# EAGLE design SO-16 (EAGLE 6.5.0)
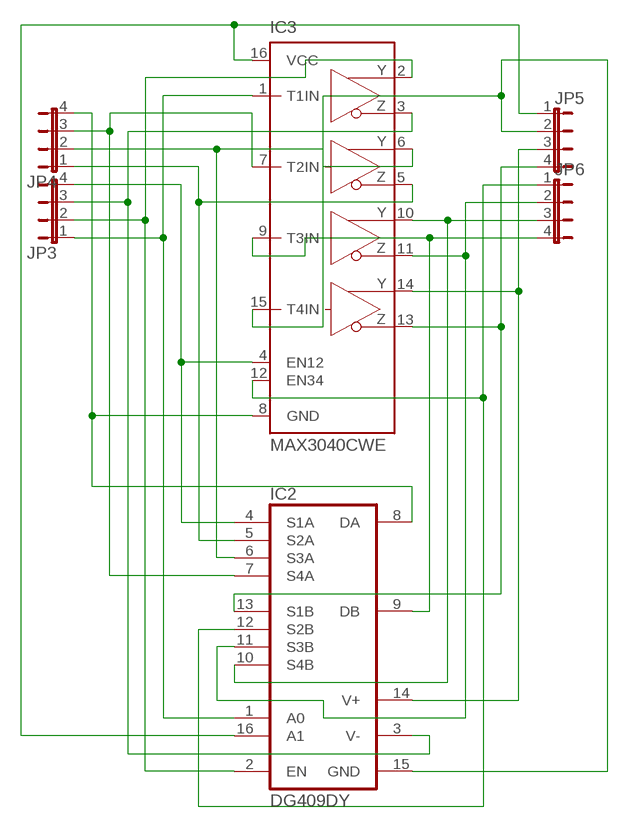
[diagram p0: schematic, sheet 1]

## Parts
IC2  DG409DY  [SO16]
IC3  MAX3040CWE  [SO16L]
JP3  JP4E  [JP4]
JP4  JP4E  [JP4]
JP5  JP4E  [JP4]
JP6  JP4E  [JP4]

## Nets
N$8: IC2.1(A0) IC3.1(T1IN) JP3.1
N$10: IC2.3(V-) IC3.3(Z1) JP3.3
N$11: IC2.2(EN) IC3.2(Y1) JP3.2
N$12: IC2.4(S1A) IC3.4(EN12) JP3.4
N$13: IC2.5(S2A) IC3.5(Z2) JP4.1
N$14: IC2.6(S3A) IC3.6(Y2) JP4.2
N$15: IC2.7(S4A) IC3.7(T2IN) JP4.3
N$16: IC2.8(DA) IC3.8(GND) JP4.4
N$17: IC2.13(S1B) IC3.13(Z4) JP5.4
N$18: IC2.9(DB) IC3.9(T3IN) JP6.4
N$19: IC2.10(S4B) IC3.10(Y3) JP6.3
N$20: IC2.12(S2B) IC3.12(EN34) JP6.1
N$21: IC2.11(S3B) IC3.11(Z3) JP6.2
N$22: IC2.15(GND) IC3.15(T4IN) JP5.2
N$23: IC2.14(V+) IC3.14(Y4) JP5.3
N$25: IC2.16(A1) IC3.16(VCC) JP5.1

## Library data of the parts
IC2 = maxim:DG409DY: ANALOG MULTIPLEXER; MF: MAXIM; MPN: DG409DY; OC_FARNELL: 9663835; OC_NEWARK: 90C1278
IC3 = maxim:MAX30*: ±10kV ESD-Protected, Quad 5V RS-485/RS-422 Transmitters Source: www.maxim-ic.com .. MAX3040-MAX3045.pdf; MPN: MAX3040CWE+; OC_FARNELL: unknown; OC_NEWARK: 68K4574
JP3-JP6 = jumper:JP4E: JUMPER

## Board
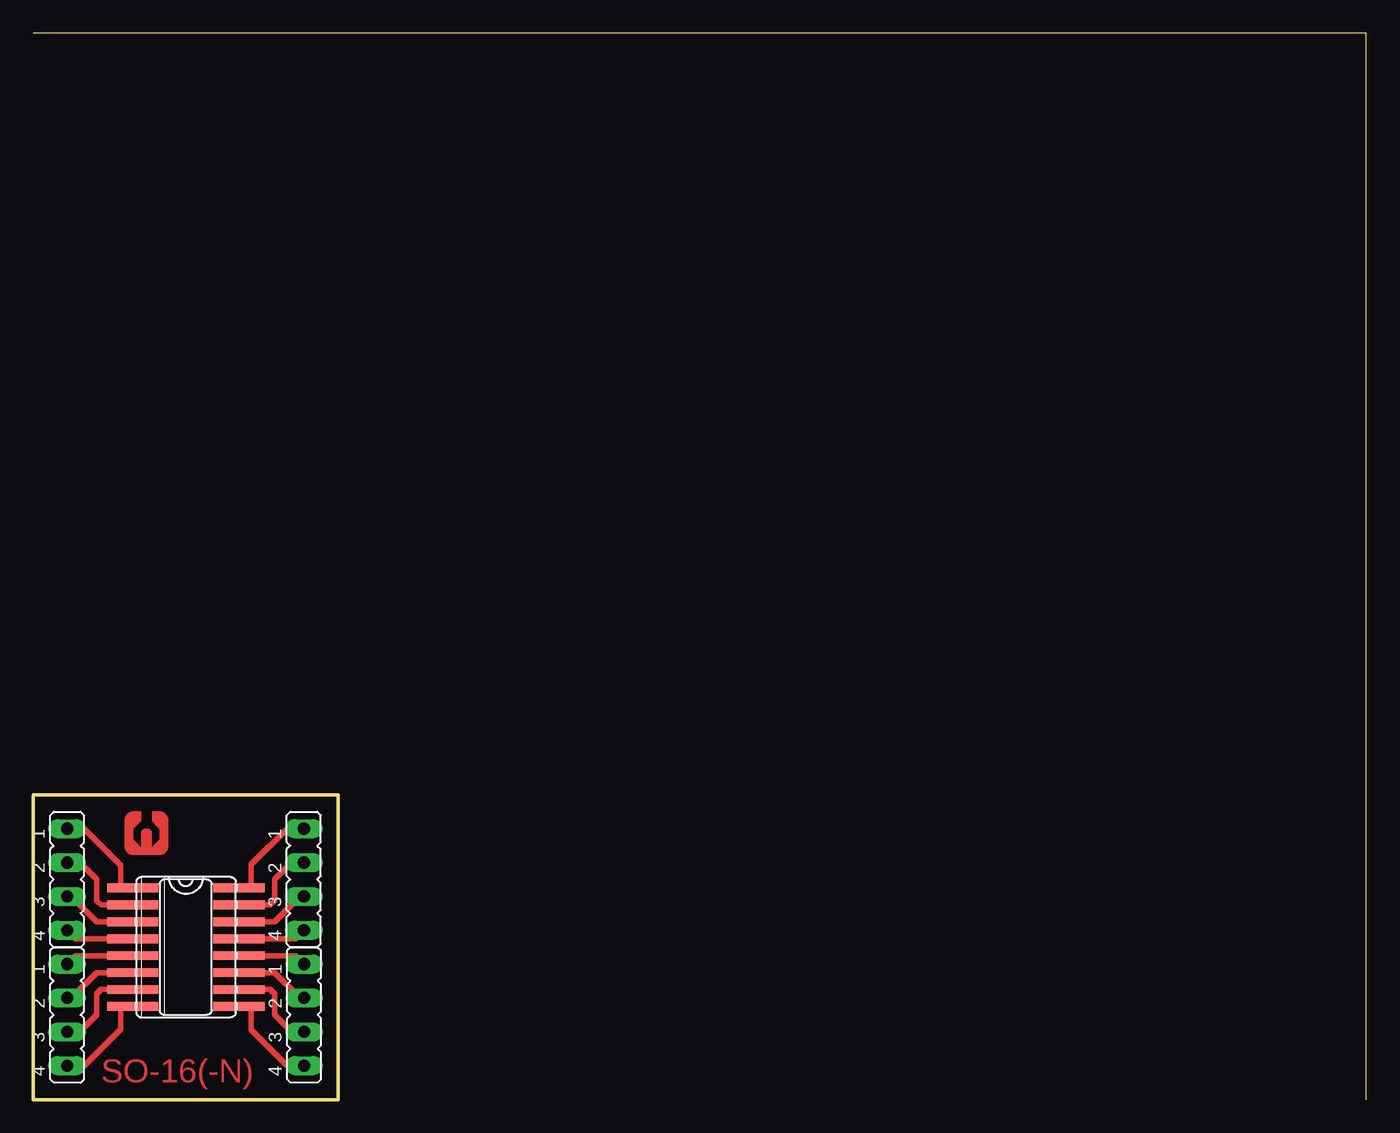
[diagram p1: board, top side]

Size 100 x 80 mm. Coordinates in mm from the lower left corner, seen from the top.
Outline: 100,0 100,80 0,80
Outline: 0,0 0,22.86 22.86,22.86 22.86,0 0,0
Copper layers (1*16): Top 0.035mm / dielectric 1.5mm / Bottom 0.035mm
Design rules "default": minimum track width 10mil, minimum drill 24mil, track to track 8mil, track to pad 8mil, pad to pad 8mil, via to via 8mil, smd to smd 8mil, copper to edge 40mil, drill to drill 8mil, minimum pad ring 10mil, minimum via ring 8mil, stop-mask expansion 4mil, vias tented up to drill 0mil, thermal gap 10mil

### Footprints (pad centres in the part's own frame; a part is rotated, then mirrored left to right if it is on the bottom)
SO16 = smd 0.66 x 2.032: 1 -4.445,-3.073; 2 -3.175,-3.073; 3 -1.905,-3.073; 4 -0.635,-3.073; 5 0.635,-3.073; 6 1.905,-3.073; 7 3.175,-3.073; 8 4.445,-3.073; 9 4.445,3.073; 10 3.175,3.073; 11 1.905,3.073; 12 0.635,3.073; 13 -0.635,3.073; 14 -1.905,3.073; 15 -3.175,3.073; 16 -4.445,3.073
SO16L = smd 0.66 x 2.032: 1 -4.445,-4.902; 2 -3.175,-4.902; 3 -1.905,-4.902; 4 -0.635,-4.902; 5 0.635,-4.902; 6 1.905,-4.902; 7 3.175,-4.902; 8 4.445,-4.902; 9 4.445,4.902; 10 3.175,4.902; 11 1.905,4.902; 12 0.635,4.902; 13 -0.635,4.902; 14 -1.905,4.902; 15 -3.175,4.902; 16 -4.445,4.902
JP4 = drill 0.914 long: 1 -3.81,0; 2 -1.27,0; 3 1.27,0; 4 3.81,0

### Placement (x,y rotation side)
IC2  11.43,11.43 270 top
IC3  11.46,11.43 270 top
JP3  2.54,16.51 270 top
JP4  2.54,6.35 270 top
JP5  20.29,16.51 270 top
JP6  20.32,6.35 270 top

### Tracks (layer width: path | path; a pad name or v marks a point on that pad's centre or on a via)
N$8
  Top 0.406: IC2.1 IC3.1 6.55,17.58 3.81,20.32 JP3.1
N$10
  Top 0.406: IC2.3 IC3.3 4.76,13.34 2.86,15.24 JP3.3
N$11
  Top 0.406: IC2.2 IC3.2 5.08,14.61 4.76,14.92 4.76,16.51 3.49,17.78 JP3.2
N$12
  Top 0.406: IC2.4 IC3.4 3.17,12.06 JP3.4
N$13
  Top 0.406: IC2.5 IC3.5 3.17,10.79 JP4.1
N$14
  Top 0.406: IC2.6 IC3.6 4.76,9.53 2.86,7.62 JP4.2
N$15
  Top 0.406: IC2.7 IC3.7 5.08,8.26 4.76,7.94 4.76,6.35 3.49,5.08 JP4.3
N$16
  Top 0.406: IC2.8 IC3.8 6.55,5.28 3.81,2.54 JP4.4
N$17
  Top 0.406: IC2.13 IC3.13 19.66,12.06 JP5.4
N$18
  Top 0.406: IC2.9 IC3.9 16.36,5.23 19.05,2.54 JP6.4
N$19
  Top 0.406: IC2.10 IC3.10 17.78,8.26 18.1,7.94 18.1,6.35 19.37,5.08 JP6.3
N$20
  Top 0.406: IC2.12 IC3.12 19.68,10.79 JP6.1
N$21
  Top 0.406: IC2.11 IC3.11 18.1,9.53 20,7.62 JP6.2
N$22
  Top 0.406: IC2.15 IC3.15 17.78,14.61 18.1,14.92 18.1,16.51 19.37,17.78 JP5.2
N$23
  Top 0.406: IC2.14 IC3.14 18.1,13.34 20,15.24 JP5.3
N$25
  Top 0.406: IC2.16 IC3.16 16.36,17.63 19.05,20.32 JP5.1
(copper drawn outside any net)
  shapes: Top area x289

### Text on the board
Top: SO-16(-N)